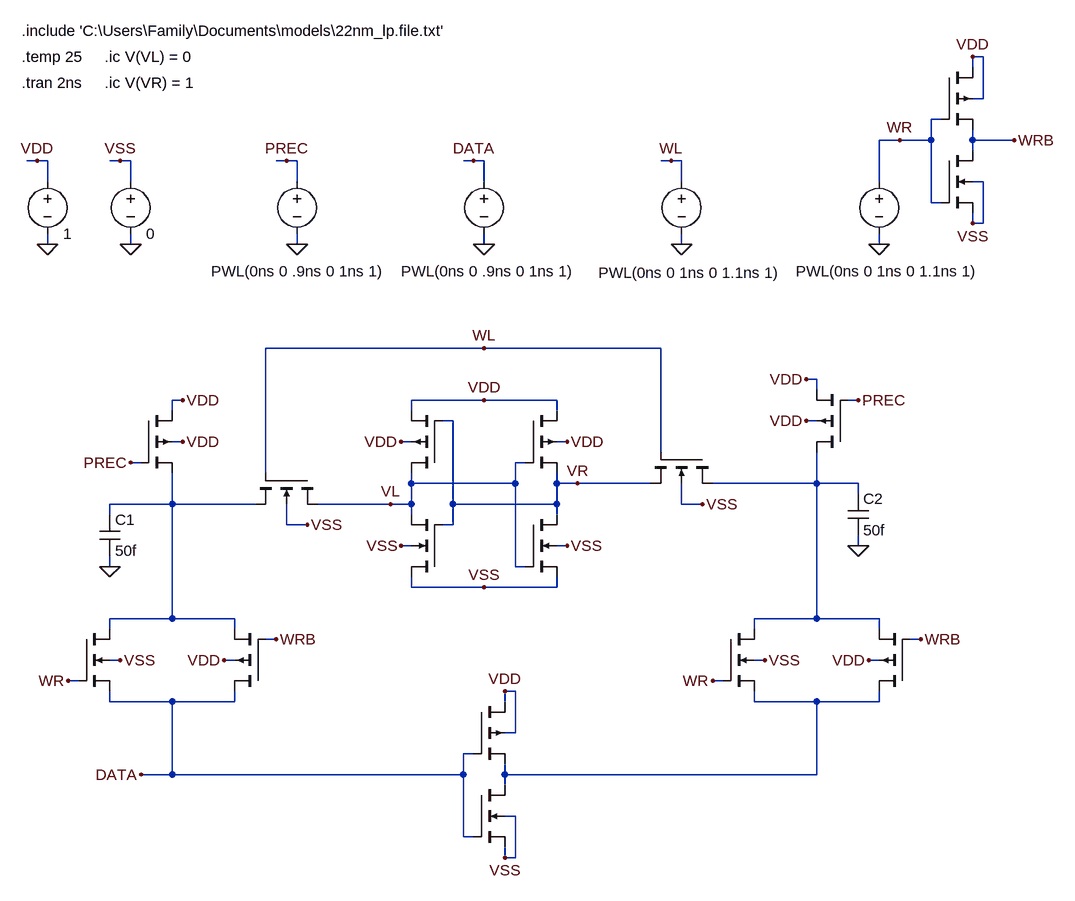
[diagram p0: schematic Stage 1 Write 1.asc]
Stage 1 Write 1.asc, the LTspice schematic file:
Version 4
SHEET 1 1568 1116
WIRE 1152 -912 1136 -912
WIRE 1136 -896 1136 -912
WIRE 1152 -848 1152 -912
WIRE 1152 -848 1136 -848
WIRE 1088 -816 1072 -816
WIRE 1024 -784 992 -784
WIRE 1072 -784 1072 -816
WIRE 1072 -784 1024 -784
WIRE 1136 -784 1136 -800
WIRE 1200 -784 1136 -784
WIRE 1136 -768 1136 -784
WIRE -304 -752 -320 -752
WIRE -288 -752 -304 -752
WIRE -176 -752 -192 -752
WIRE -160 -752 -176 -752
WIRE 80 -752 64 -752
WIRE 96 -752 80 -752
WIRE 368 -752 352 -752
WIRE 384 -752 368 -752
WIRE 672 -752 656 -752
WIRE 688 -752 672 -752
WIRE -288 -720 -288 -752
WIRE -160 -720 -160 -752
WIRE 96 -720 96 -752
WIRE 384 -720 384 -752
WIRE 688 -720 688 -752
WIRE 992 -720 992 -784
WIRE 1152 -720 1136 -720
WIRE 1072 -688 1072 -784
WIRE 1088 -688 1072 -688
WIRE 1136 -656 1136 -672
WIRE 1152 -656 1152 -720
WIRE 1152 -656 1136 -656
WIRE -288 -624 -288 -640
WIRE -160 -624 -160 -640
WIRE 96 -624 96 -640
WIRE 384 -624 384 -640
WIRE 688 -624 688 -640
WIRE 992 -624 992 -640
WIRE 384 -464 48 -464
WIRE 656 -464 384 -464
WIRE 896 -416 880 -416
WIRE 896 -400 896 -416
WIRE -80 -384 -96 -384
WIRE 384 -384 272 -384
WIRE 496 -384 384 -384
WIRE 960 -384 944 -384
WIRE -96 -368 -96 -384
WIRE 272 -368 272 -384
WIRE 496 -368 496 -384
WIRE 336 -352 320 -352
WIRE 896 -352 880 -352
WIRE -80 -320 -96 -320
WIRE 272 -320 256 -320
WIRE 512 -320 496 -320
WIRE 656 -304 656 -464
WIRE -144 -288 -160 -288
WIRE 448 -288 432 -288
WIRE 48 -272 48 -464
WIRE 272 -256 272 -272
WIRE 432 -256 432 -288
WIRE 432 -256 272 -256
WIRE 496 -256 496 -272
WIRE 528 -256 496 -256
WIRE 640 -256 528 -256
WIRE 896 -256 896 -304
WIRE 896 -256 736 -256
WIRE 960 -256 896 -256
WIRE 960 -240 960 -256
WIRE -96 -224 -96 -272
WIRE -96 -224 -192 -224
WIRE 32 -224 -96 -224
WIRE 240 -224 128 -224
WIRE 272 -224 272 -256
WIRE 272 -224 240 -224
WIRE 336 -224 336 -352
WIRE 496 -224 496 -256
WIRE 496 -224 336 -224
WIRE 688 -224 688 -256
WIRE 720 -224 688 -224
WIRE -192 -208 -192 -224
WIRE 272 -208 272 -224
WIRE 496 -208 496 -224
WIRE 80 -192 80 -224
WIRE 112 -192 80 -192
WIRE 336 -192 336 -224
WIRE 336 -192 320 -192
WIRE 272 -160 256 -160
WIRE 512 -160 496 -160
WIRE 960 -160 960 -176
WIRE -192 -128 -192 -144
WIRE 432 -128 432 -256
WIRE 448 -128 432 -128
WIRE 272 -96 272 -112
WIRE 384 -96 272 -96
WIRE 496 -96 496 -112
WIRE 496 -96 384 -96
WIRE -96 -48 -96 -224
WIRE -96 -48 -192 -48
WIRE 0 -48 -96 -48
WIRE 896 -48 896 -256
WIRE 896 -48 800 -48
WIRE 992 -48 896 -48
WIRE -192 -32 -192 -48
WIRE 0 -32 0 -48
WIRE 800 -32 800 -48
WIRE 992 -32 992 -48
WIRE 64 -16 48 -16
WIRE 1056 -16 1040 -16
WIRE -176 16 -192 16
WIRE 0 16 -16 16
WIRE 816 16 800 16
WIRE 992 16 976 16
WIRE -240 48 -256 48
WIRE 752 48 736 48
WIRE 432 64 416 64
WIRE -192 80 -192 64
WIRE -96 80 -192 80
WIRE 0 80 0 64
WIRE 0 80 -96 80
WIRE 416 80 416 64
WIRE 800 80 800 64
WIRE 896 80 800 80
WIRE 992 80 992 64
WIRE 992 80 896 80
WIRE 432 128 432 64
WIRE 432 128 416 128
WIRE 368 160 352 160
WIRE -96 192 -96 80
WIRE -96 192 -144 192
WIRE 352 192 352 160
WIRE 352 192 -96 192
WIRE 416 192 416 176
WIRE 896 192 896 80
WIRE 896 192 416 192
WIRE 416 208 416 192
WIRE 432 256 416 256
WIRE 352 288 352 192
WIRE 368 288 352 288
WIRE 416 320 416 304
WIRE 432 320 432 256
WIRE 432 320 416 320
FLAG -288 -624 0
FLAG -160 -624 0
FLAG -304 -752 VDD
FLAG -176 -752 VSS
FLAG 256 -320 VDD
FLAG 512 -320 VDD
FLAG 512 -160 VSS
FLAG 256 -160 VSS
FLAG 384 -384 VDD
FLAG 384 -96 VSS
FLAG -16 16 VDD
FLAG -176 16 VSS
FLAG 976 16 VDD
FLAG 816 16 VSS
FLAG 416 64 VDD
FLAG 416 320 VSS
FLAG -80 -384 VDD
FLAG 880 -416 VDD
FLAG -80 -320 VDD
FLAG 880 -352 VDD
FLAG 384 -464 WL
FLAG 112 -192 VSS
FLAG 720 -224 VSS
FLAG -192 -128 0
FLAG 960 -160 0
FLAG 96 -624 0
FLAG 688 -624 0
FLAG 992 -624 0
FLAG 1136 -912 VDD
FLAG 1136 -656 VSS
FLAG 1200 -784 WRB
FLAG 1024 -784 WR
FLAG 672 -752 WL
FLAG 80 -752 PREC
FLAG 384 -624 0
FLAG 368 -752 DATA
FLAG -160 -288 PREC
FLAG 960 -384 PREC
FLAG -256 48 WR
FLAG 736 48 WR
FLAG 64 -16 WRB
FLAG 1056 -16 WRB
FLAG -144 192 DATA
FLAG 240 -224 VL
FLAG 528 -256 VR
SYMBOL pmos4 320 -272 R180
WINDOW 0 56 32 Invisible 2
WINDOW 3 56 72 Invisible 2
SYMATTR InstName M1
SYMATTR Value2 l=0.03u w=0.7u
SYMBOL pmos4 448 -368 R0
WINDOW 0 56 32 Invisible 2
WINDOW 3 56 72 Invisible 2
SYMATTR InstName M2
SYMATTR Value2 l=0.03u w=0.7u
SYMBOL nmos4 320 -112 R180
WINDOW 0 56 32 Invisible 2
WINDOW 3 56 72 Invisible 2
SYMATTR InstName M3
SYMATTR Value2 l=0.03u w=0.4u
SYMBOL nmos4 448 -208 R0
WINDOW 0 56 32 Invisible 2
WINDOW 3 56 72 Invisible 2
SYMATTR InstName M4
SYMATTR Value2 l=0.03u w=0.4u
SYMBOL voltage -288 -736 R0
WINDOW 123 0 0 Left 2
WINDOW 39 0 0 Left 2
WINDOW 0 24 16 Invisible 2
SYMATTR InstName V1
SYMATTR Value 1
SYMBOL voltage -160 -736 R0
WINDOW 123 0 0 Left 2
WINDOW 39 0 0 Left 2
WINDOW 0 24 16 Invisible 2
SYMATTR InstName V2
SYMATTR Value 0
SYMBOL pmos4 48 64 R180
WINDOW 0 56 32 Invisible 2
WINDOW 3 56 72 Invisible 2
SYMATTR InstName M5
SYMATTR Value2 l=0.03u w=0.7u
SYMBOL nmos4 -240 -32 R0
WINDOW 0 56 32 Invisible 2
WINDOW 3 56 72 Invisible 2
SYMATTR InstName M6
SYMATTR Value2 l=0.03u w=0.4u
SYMBOL pmos4 1040 64 R180
WINDOW 0 56 32 Invisible 2
WINDOW 3 56 72 Invisible 2
SYMATTR InstName M7
SYMATTR Value2 l=0.03u w=0.7u
SYMBOL nmos4 752 -32 R0
WINDOW 0 56 32 Invisible 2
WINDOW 3 56 72 Invisible 2
SYMATTR InstName M8
SYMATTR Value2 l=0.03u w=0.4u
SYMBOL pmos4 368 80 R0
WINDOW 0 56 32 Invisible 2
WINDOW 3 56 72 Invisible 2
SYMATTR InstName M9
SYMATTR Value2 l=0.03u w=0.7u
SYMBOL nmos4 368 208 R0
WINDOW 0 56 32 Invisible 2
WINDOW 3 56 72 Invisible 2
SYMATTR InstName M10
SYMATTR Value2 l=0.03u w=0.4u
SYMBOL pmos4 -144 -368 R0
WINDOW 0 56 32 Invisible 2
WINDOW 3 56 72 Invisible 2
SYMATTR InstName M11
SYMATTR Value2 l=0.03u w=0.7u
SYMBOL pmos4 944 -304 R180
WINDOW 0 56 32 Invisible 2
WINDOW 3 56 72 Invisible 2
SYMATTR InstName M12
SYMATTR Value2 l=0.03u w=0.7u
SYMBOL nmos4 128 -272 R90
WINDOW 0 56 32 Invisible 2
WINDOW 3 56 72 Invisible 2
SYMATTR InstName M13
SYMATTR Value2 l=0.03u w=0.8u
SYMBOL nmos4 736 -304 R90
WINDOW 0 56 32 Invisible 2
WINDOW 3 56 72 Invisible 2
SYMATTR InstName M14
SYMATTR Value2 l=0.03u w=0.8u
SYMBOL cap -208 -208 R0
SYMATTR InstName C1
SYMATTR Value 50f
SYMBOL cap 944 -240 R0
SYMATTR InstName C2
SYMATTR Value 50f
SYMBOL voltage 96 -736 R0
WINDOW 123 0 0 Left 2
WINDOW 39 0 0 Left 2
WINDOW 0 24 16 Invisible 2
WINDOW 3 -132 154 Left 2
SYMATTR InstName V3
SYMATTR Value PWL(0ns 0 .9ns 0 1ns 1)
SYMBOL voltage 688 -736 R0
WINDOW 123 0 0 Left 2
WINDOW 39 0 0 Left 2
WINDOW 0 24 16 Invisible 2
WINDOW 3 -128 156 Left 2
SYMATTR InstName V4
SYMATTR Value PWL(0ns 0 1ns 0 1.1ns 1)
SYMBOL voltage 992 -736 R0
WINDOW 123 0 0 Left 2
WINDOW 39 0 0 Left 2
WINDOW 0 24 16 Invisible 2
WINDOW 3 -128 154 Left 2
SYMATTR InstName V5
SYMATTR Value PWL(0ns 0 1ns 0 1.1ns 1)
SYMBOL pmos4 1088 -896 R0
WINDOW 0 56 32 Invisible 2
WINDOW 3 56 72 Invisible 2
SYMATTR InstName M15
SYMATTR Value2 l=0.03u w=0.7u
SYMBOL nmos4 1088 -768 R0
WINDOW 0 56 32 Invisible 2
WINDOW 3 56 72 Invisible 2
SYMATTR InstName M16
SYMATTR Value2 l=0.03u w=0.4u
SYMBOL voltage 384 -736 R0
WINDOW 123 0 0 Left 2
WINDOW 39 0 0 Left 2
WINDOW 0 24 16 Invisible 2
WINDOW 3 -128 154 Left 2
SYMATTR InstName V6
SYMATTR Value PWL(0ns 0 .9ns 0 1ns 1)
TEXT -328 -952 Left 2 !.include 'C:\\Users\\Family\\Documents\\models\\22nm_lp.file.txt'
TEXT -328 -912 Left 2 !.temp 25
TEXT -328 -872 Left 2 !.tran 2ns
TEXT -200 -912 Left 2 !.ic V(VL) = 0
TEXT -200 -872 Left 2 !.ic V(VR) = 1

The netlist it stands for:
* Stage 1 Write 1.asc
M1 VL VR VDD VDD PMOS l=0.03u w=0.7u
M2 VDD VL VR VDD PMOS l=0.03u w=0.7u
M3 VSS VR VL VSS NMOS l=0.03u w=0.4u
M4 VR VL VSS VSS NMOS l=0.03u w=0.4u
V1 VDD 0 1
V2 VSS 0 0
M5 DATA WRB N002 VDD PMOS l=0.03u w=0.7u
M6 N002 WR DATA VSS NMOS l=0.03u w=0.4u
M7 N003 WRB N001 VDD PMOS l=0.03u w=0.7u
M8 N001 WR N003 VSS NMOS l=0.03u w=0.4u
M9 VDD DATA N003 VDD PMOS l=0.03u w=0.7u
M10 N003 DATA VSS VSS NMOS l=0.03u w=0.4u
M11 VDD PREC N002 VDD PMOS l=0.03u w=0.7u
M12 N001 PREC VDD VDD PMOS l=0.03u w=0.7u
M13 VL WL N002 VSS NMOS l=0.03u w=0.8u
M14 N001 WL VR VSS NMOS l=0.03u w=0.8u
C1 N002 0 50f
C2 N001 0 50f
V3 PREC 0 PWL(0ns 0 .9ns 0 1ns 1)
V4 WL 0 PWL(0ns 0 1ns 0 1.1ns 1)
V5 WR 0 PWL(0ns 0 1ns 0 1.1ns 1)
M15 VDD WR WRB VDD PMOS l=0.03u w=0.7u
M16 WRB WR VSS VSS NMOS l=0.03u w=0.4u
V6 DATA 0 PWL(0ns 0 .9ns 0 1ns 1)
.model NMOS NMOS
.model PMOS PMOS
.lib standard.mos
.include 'C:\Users\Family\Documents\models\22nm_lp.file.txt'
.temp 25
.tran 2ns
.ic V(VL) = 0
.ic V(VR) = 1
.backanno
.end